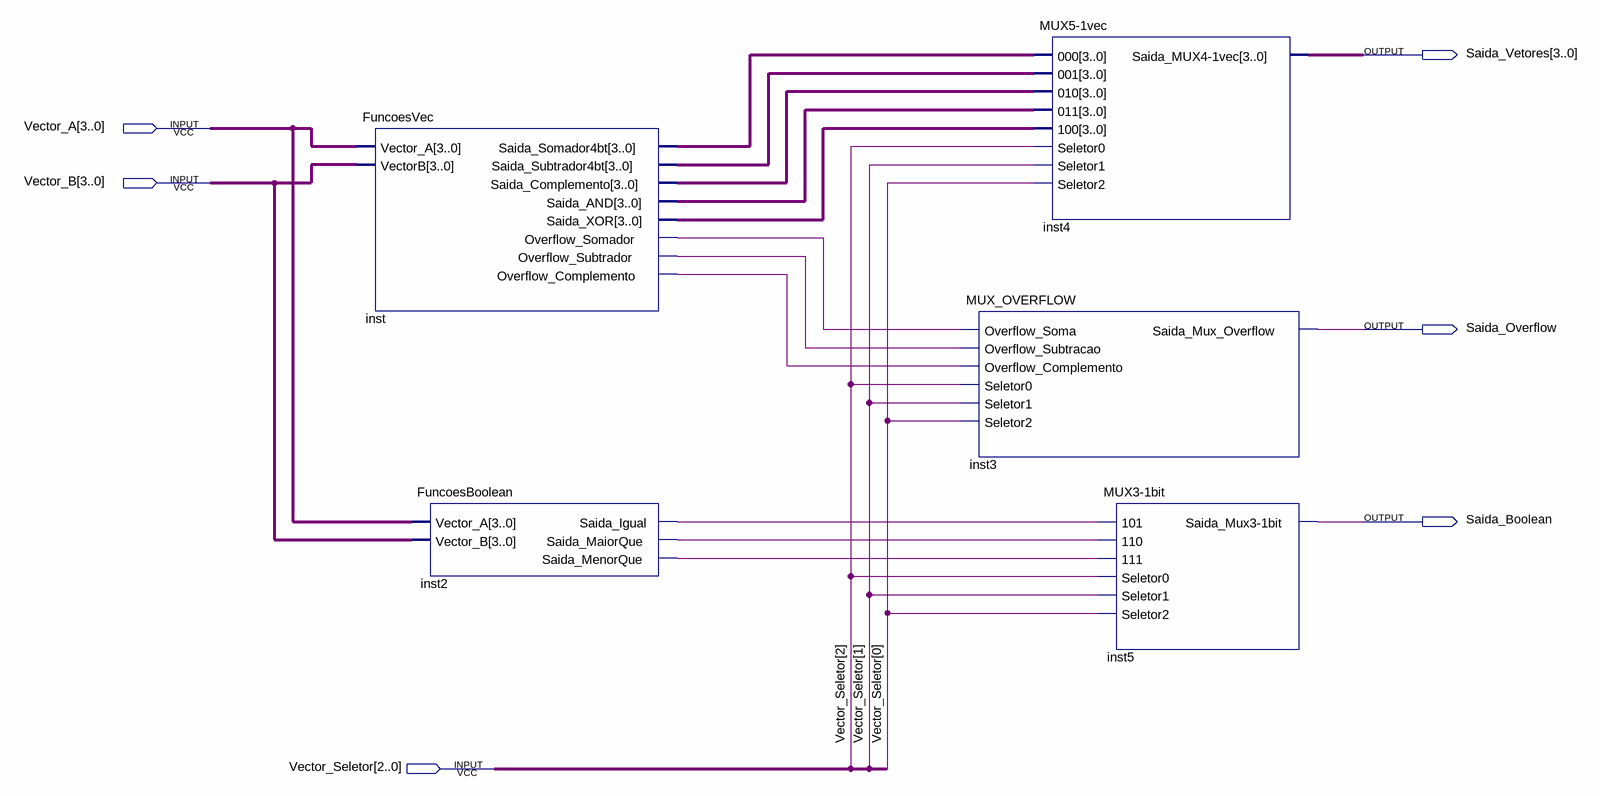
[diagram p0: schematic sheet]
// Quartus schematic ULA.bdf as structural Verilog: 5 symbols, 6 pins
module ULA (
  input  [3:0] Vector_A,
  input  [3:0] Vector_B,
  input  [2:0] Vector_Seletor,
  output [3:0] Saida_Vetores,
  output Saida_Overflow,
  output Saida_Boolean
);

  wire inst2_saida_igual, inst2_saida_maiorque, inst2_saida_menorque, inst_overflow_complemento,
       inst_overflow_somador, inst_overflow_subtrador;
  wire [3:0] inst_saida_and, inst_saida_complemento, inst_saida_somador4bt, inst_saida_subtrador4bt,
       inst_saida_xor;

  FuncoesVec inst (
    .Vector_A(Vector_A), .VectorB(Vector_B), .Saida_Somador4bt(inst_saida_somador4bt),
    .Saida_Subtrador4bt(inst_saida_subtrador4bt), .Saida_Complemento(inst_saida_complemento),
    .Saida_AND(inst_saida_and), .Saida_XOR(inst_saida_xor), .Overflow_Somador(inst_overflow_somador),
    .Overflow_Subtrador(inst_overflow_subtrador), .Overflow_Complemento(inst_overflow_complemento));
  FuncoesBoolean inst2 (
    .Vector_A(Vector_A), .Vector_B(Vector_B), .Saida_Igual(inst2_saida_igual),
    .Saida_MaiorQue(inst2_saida_maiorque), .Saida_MenorQue(inst2_saida_menorque));
  MUX_OVERFLOW inst3 (
    .Overflow_Soma(inst_overflow_somador), .Overflow_Subtracao(inst_overflow_subtrador),
    .Overflow_Complemento(inst_overflow_complemento), .Seletor0(Vector_Seletor[2]),
    .Seletor1(Vector_Seletor[1]), .Seletor2(Vector_Seletor[0]), .Saida_Mux_Overflow(Saida_Overflow));
  \MUX5-1vec  inst4 (
    .\000 (inst_saida_somador4bt), .\001 (inst_saida_subtrador4bt), .\010 (inst_saida_complemento),
    .\011 (inst_saida_and), .\100 (inst_saida_xor), .Seletor0(Vector_Seletor[2]),
    .Seletor1(Vector_Seletor[1]), .Seletor2(Vector_Seletor[0]), .\Saida_MUX4-1vec (Saida_Vetores));
  \MUX3-1bit  inst5 (
    .\101 (inst2_saida_igual), .\110 (inst2_saida_maiorque), .\111 (inst2_saida_menorque),
    .Seletor0(Vector_Seletor[2]), .Seletor1(Vector_Seletor[1]), .Seletor2(Vector_Seletor[0]),
    .\Saida_Mux3-1bit (Saida_Boolean));
endmodule
